# EAGLE schematic log (EAGLE 6.5.0)
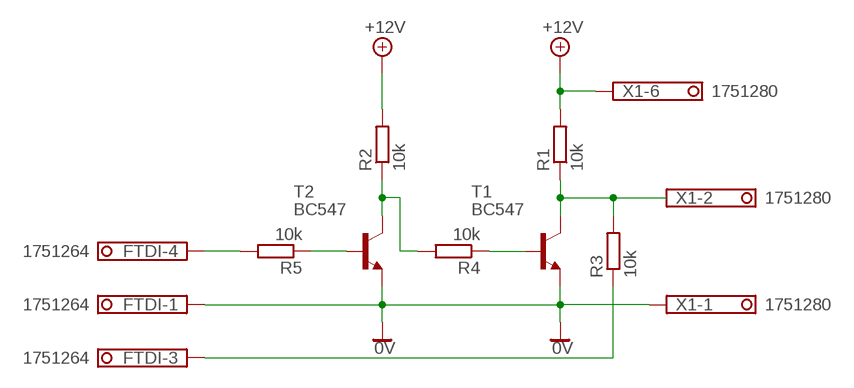
[diagram p0: schematic, sheet 1]

## Parts
FTDI  1751264  [1751264]
R1  10k  R-EU_0204/5  [0204/5]
R2  10k  R-EU_0204/5  [0204/5]
R3  10k  R-EU_0204/5  [0204/5]
R4  10k  R-EU_0204/5  [0204/5]
R5  10k  R-EU_0204/5  [0204/5]
T1  BC547  [TO92]
T2  BC547  [TO92]
X1  1751280  [1751280]

## Nets
0V: FTDI.1 T1.1(E) T2.1(E) X1.1
+12V: R1.2 R2.2 X1.6
N$1: R4.1 T1.2(B)
N$2: R2.1 R4.2 T2.3(C)
N$3: R1.1 R3.2 T1.3(C)
N$4: R5.1 T2.2(B)
N$5: FTDI.3 R3.1
N$6: FTDI.4 R5.2
Unconnected: FTDI.2 X1.2 X1.3 X1.4 X1.5

## Library data of the parts
FTDI = con-phoenix-350:1751264: MKDS 1/ 4-3,5 Printklemme Nennstrom: 10 A Bemessungsspannung: 160 V Raster: 3,5 mm Polzahl: 4 Montageart: Löten Anschlussart: Schraubanschluss Anschlussrichtung vom Leiter zur Platine: 0° Source: http://eshop.phoenixcontact.com .. 1751264.pdf; MPN: 1751264; OC_FARNELL: unknown; OC_NEWARK: 10R0934
R1-R5 = rcl:R-EU_: RESISTOR, European symbol
T1 T2 = transistor:BC547: NPN TRANSISTOR
X1 = con-phoenix-350:1751280: MKDS 1/ 6-3,5 Printklemme Nennstrom: 10 A Bemessungsspannung: 160 V Raster: 3,5 mm Polzahl: 6 Montageart: Löten Anschlussart: Schraubanschluss Anschlussrichtung vom Leiter zur Platine: 0° Source: http://eshop.phoenixcontact.com .. 1751280.pdf; MPN: 1751280; OC_FARNELL: unknown; OC_NEWARK: 27R1765